# EAGLE design LANTERN_4LED (EAGLE 7.6.0)
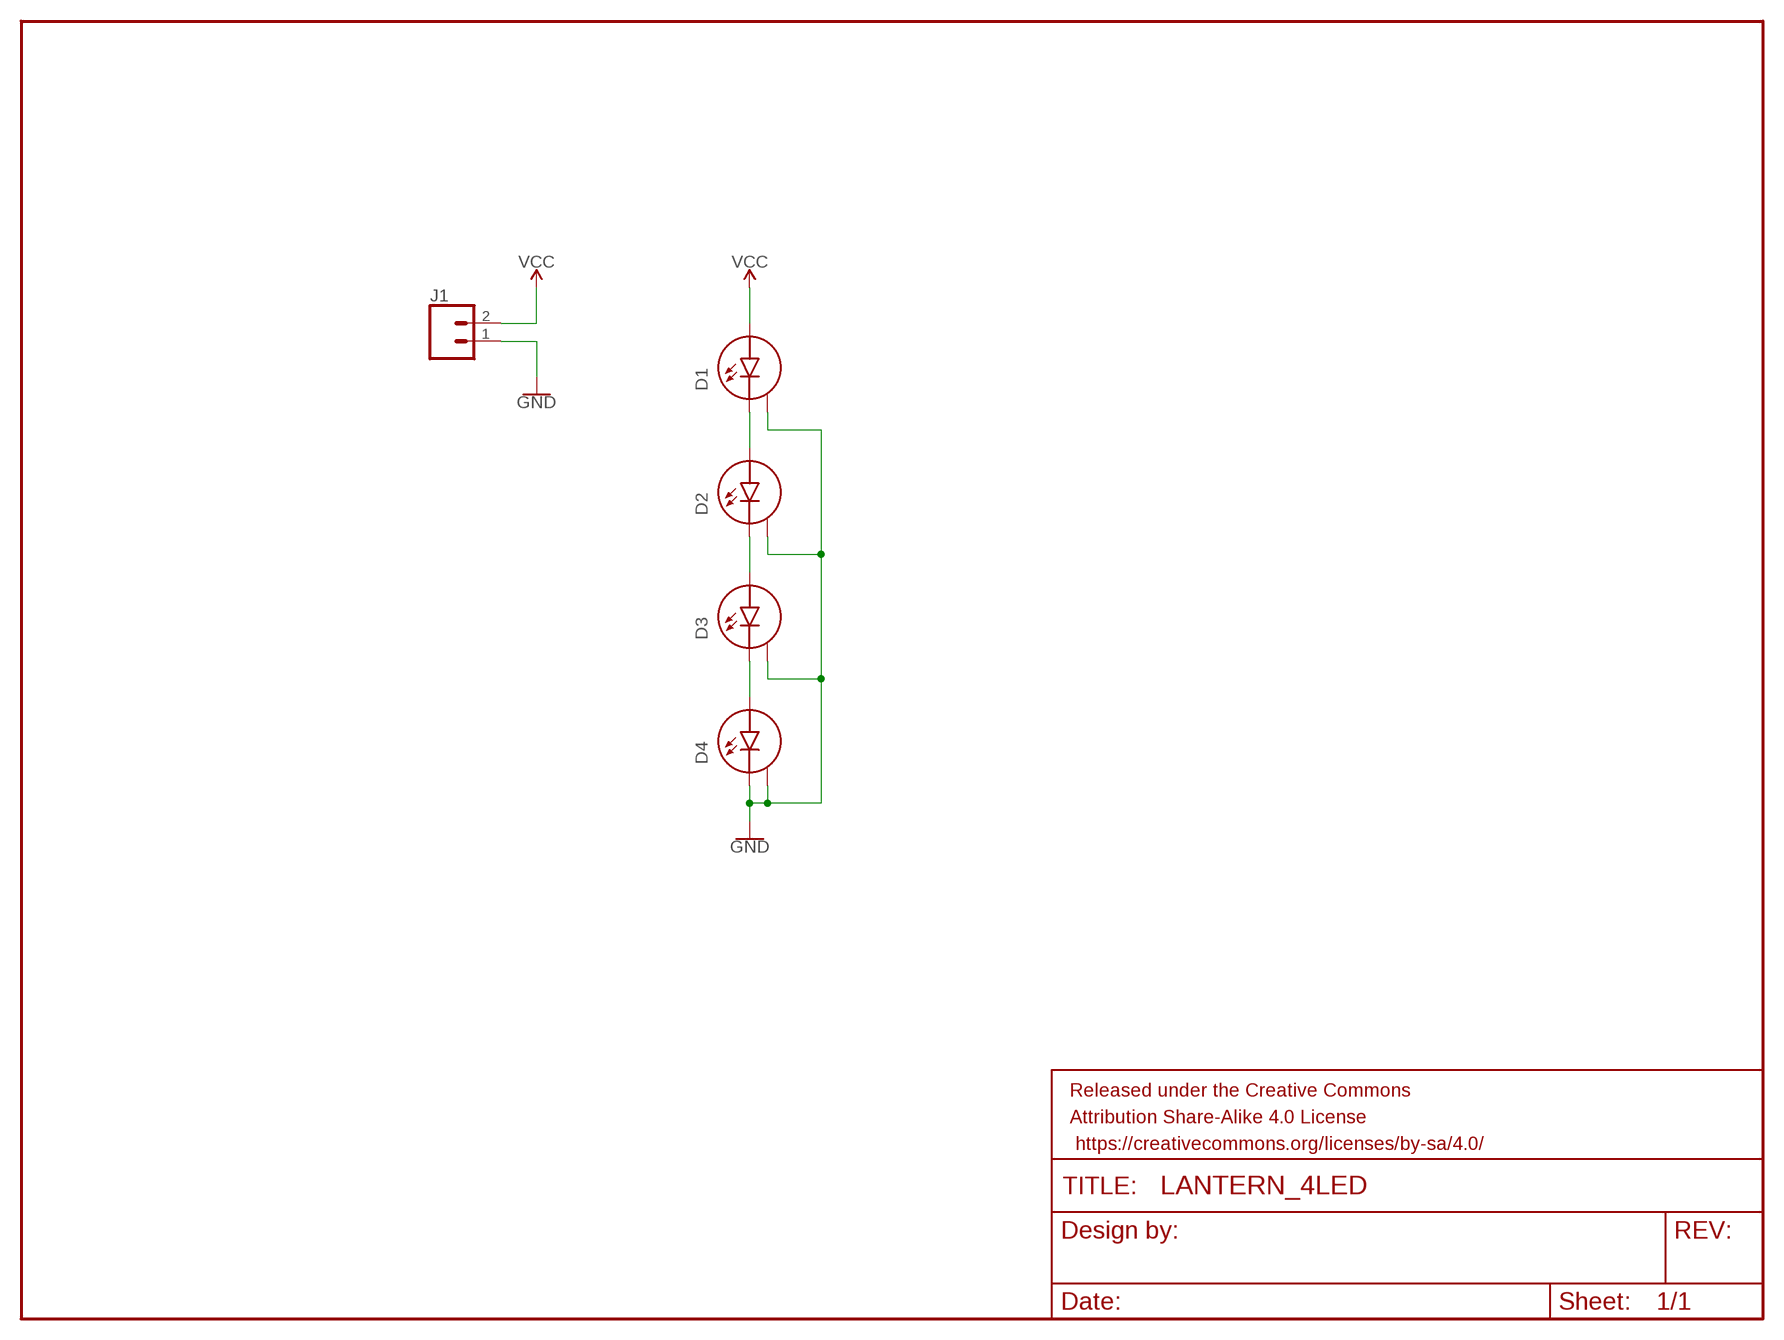
[diagram p0: schematic, sheet 1]

## Parts
D1  LED_H1414_H  [LED_1414]
D2  LED_H1414_H  [LED_1414]
D3  LED_H1414_H  [LED_1414]
D4  LED_H1414_H  [LED_1414]
FRAME1  FRAME-LETTERNO_PACKAGE  [DUMMY]
J1  CONN_02PTH3  [1X02_LONGPADS]

## Nets
GND: D1.H D2.H D3.H D4.C D4.H J1.1
N$1: D1.C D2.A
N$2: D2.C D3.A
N$3: D3.C D4.A
VCC: D1.A J1.2

## Library data of the parts
D1-D4 = my_library:LED_H: LED with Heatsink High power LED with conductive material for heat dissipation.
FRAME1 = SparkFun-Aesthetics:FRAME-LETTER: Schematic Frame - Letter Standard 8.5x11 US Letter frame; DESIGNER: Nobody; VERSION: v01
J1 = SparkFun-Connectors:CONN_02: Multi connection point. Often used as Generic Header-pin footprint for 0.1 inch spaced/style header connections On any of the 0.1 inch spaced packages, you can populate with these: Break Away Headers - Straight <https://www.sparkfun.com/products/116> (PRT-00116) Break Away Male Headers - Right Angle <https://www.sparkfun.com/products/553> (PRT-00553) Female Headers <https://www.sparkfun.com/products/115> (PRT-00115) Break Away Headers - Machine Pin <https://www.sparkfun.com/products/117> (PRT-00117) Break Away Female Headers - Swiss Machine Pin <https://www.sparkfun.com/products/743> (PRT-00743) For SCREWTERMINALS and SPRING TERMINALS visit here: Screw Terimnals on SparkFun.com <https://www.sparkfun.com/search/results?term=Screw+Terminals> (5mm/3.5mm/2.54mm spacing) This device is also useful as a general connection point to wire up your design to another part of your project. Our various solder wires solder well into these plated through hole pads. Hook-Up Wire - Assortment (Stranded, 22 AWG) <https://www.sparkfun.com/products/11375> (PRT-11375) Hook-Up Wire - Assortment (Solid Core, 22 AWG) <https://www.sparkfun.com/products/11367> (PRT-11367) View the entire wire category on our website here <https://www.sparkfun.com/categories/141> Special notes: Molex polarized connector foot print use with: PRT-08233 with associated crimp pins and housings. 2.54_SCREWTERM for use with PRT-10571. 3.5mm Screw Terminal footprints for PRT-08084 5mm Screw Terminal footprints for use with PRT-08432

## Board
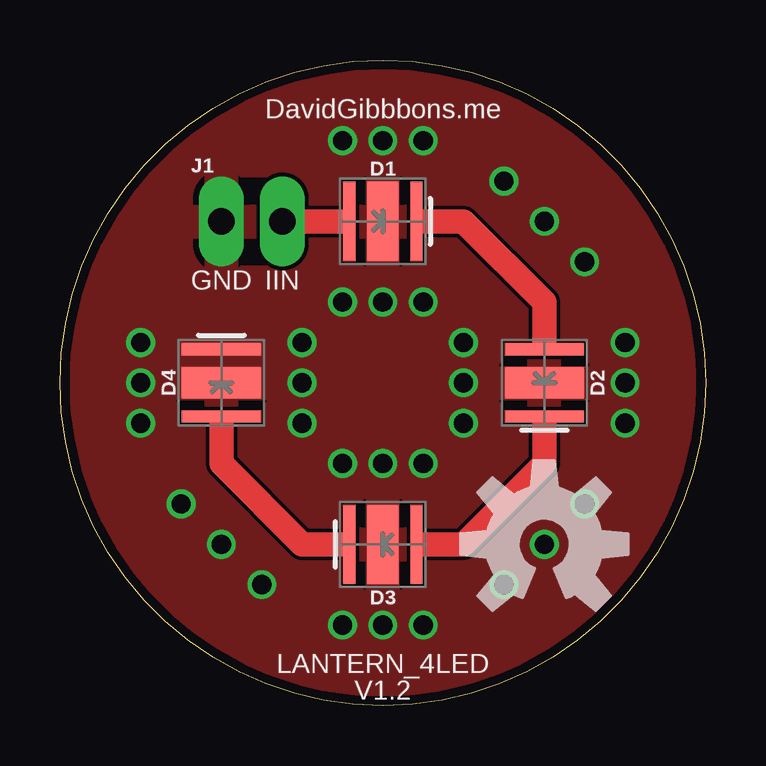
[diagram p1: board, top side]
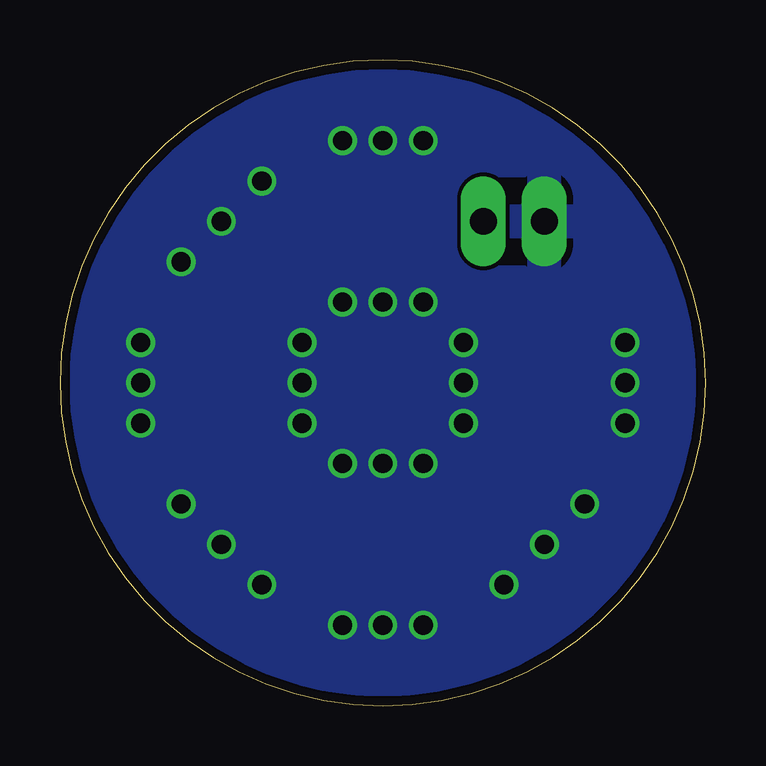
[diagram p2: board, bottom side, seen from below]

Size 26.92 x 26.92 mm. Coordinates in mm from the lower left corner, seen from the top.
Outline: 0,13.46 arc-90 13.46,26.92 arc-90 26.92,13.46 arc-90 13.46,0 arc-90 0,13.46
Copper layers (1*16): Top 0.0356mm / dielectric 1.5011mm / Bottom 0.0356mm
Design rules "LaenPCBOrder": minimum track width 6mil, minimum drill 13mil, track to track 6mil, track to pad 6mil, pad to pad 6mil, via to via 6mil, smd to smd 6mil, copper to edge 15mil, drill to drill 6mil, minimum pad ring 7mil, minimum via ring 7mil, stop-mask expansion 3mil, vias tented up to drill 0mil, thermal gap 10mil

### Footprints (pad centres in the part's own frame; a part is rotated, then mirrored left to right if it is on the bottom)
LED_1414 = smd 0.508 x 3.302: A -1.4,0; C 1.4,0 | smd 1.321 x 3.302: H 0,0
1X02_LONGPADS = drill 1.118 pad 1.88 long: 1 0,0; 2 2.54,0

### Placement (x,y rotation side)
D1  13.46,20.19 0 top
D2  20.19,13.46 270 top
D3  13.46,6.73 180 top
D4  6.73,13.46 90 top
FRAME1  0,0 0 top
J1  6.73,20.19 0 top
U$1  [OSHW-LOGO-L]  20.19,6.73 0 top

### Tracks (layer width: path | path; a pad name or v marks a point on that pad's centre or on a via)
GND  (via drill 0.8)
  other vias: 3.37,13.46 10.1,13.46 13.46,16.83 13.46,23.56 16.83,13.46 13.46,10.1 23.56,13.46 13.46,3.37 6.73,6.73 20.19,20.19 20.19,6.73 10.1,15.14 10.1,11.78 15.14,10.1 16.83,11.78 16.83,15.14 15.14,16.83 11.78,16.83 15.14,23.56 11.78,23.56 23.56,11.78 23.56,15.14 3.37,15.14 3.37,11.78 11.78,3.37 15.14,3.37 8.41,5.05 11.78,10.1 18.51,21.88 21.88,18.51 5.05,8.41 21.88,8.41 18.51,5.05
  pour Bottom: 0,13.46 arc-90 13.46,26.92 arc-90 26.92,13.46 arc-90 13.46,0 arc-90
  pour Top: 0,13.46 arc-90 13.46,26.92 arc-90 26.92,13.46 arc-90 13.46,0 arc-90
N$1
  Top 0.254: D1.C 15.14,20.19 | 20.19,15.14 D2.A
  Top 1.016: 15.14,20.19 16.83,20.19 20.19,16.83 20.19,15.14
N$2
  Top 0.254: D3.A 15.14,6.73 | 20.19,11.78 D2.C
  Top 1.016: 15.14,6.73 16.83,6.73 20.19,10.1 20.19,11.78
N$3
  Top 0.254: D4.A 6.73,11.78 | 11.78,6.73 D3.C
  Top 1.016: 6.73,11.78 6.73,10.1 10.1,6.73 11.78,6.73
VCC
  Top 0.254: 11.78,20.19 D1.A
  Top 1.016: J1.2 11.78,20.19

### Text on the board
tPlace: DavidGibbbons.me | GND | IIN | LANTERN_4LED | V1.2